# EAGLE schematic 5250_converter (EAGLE 9.6.1)
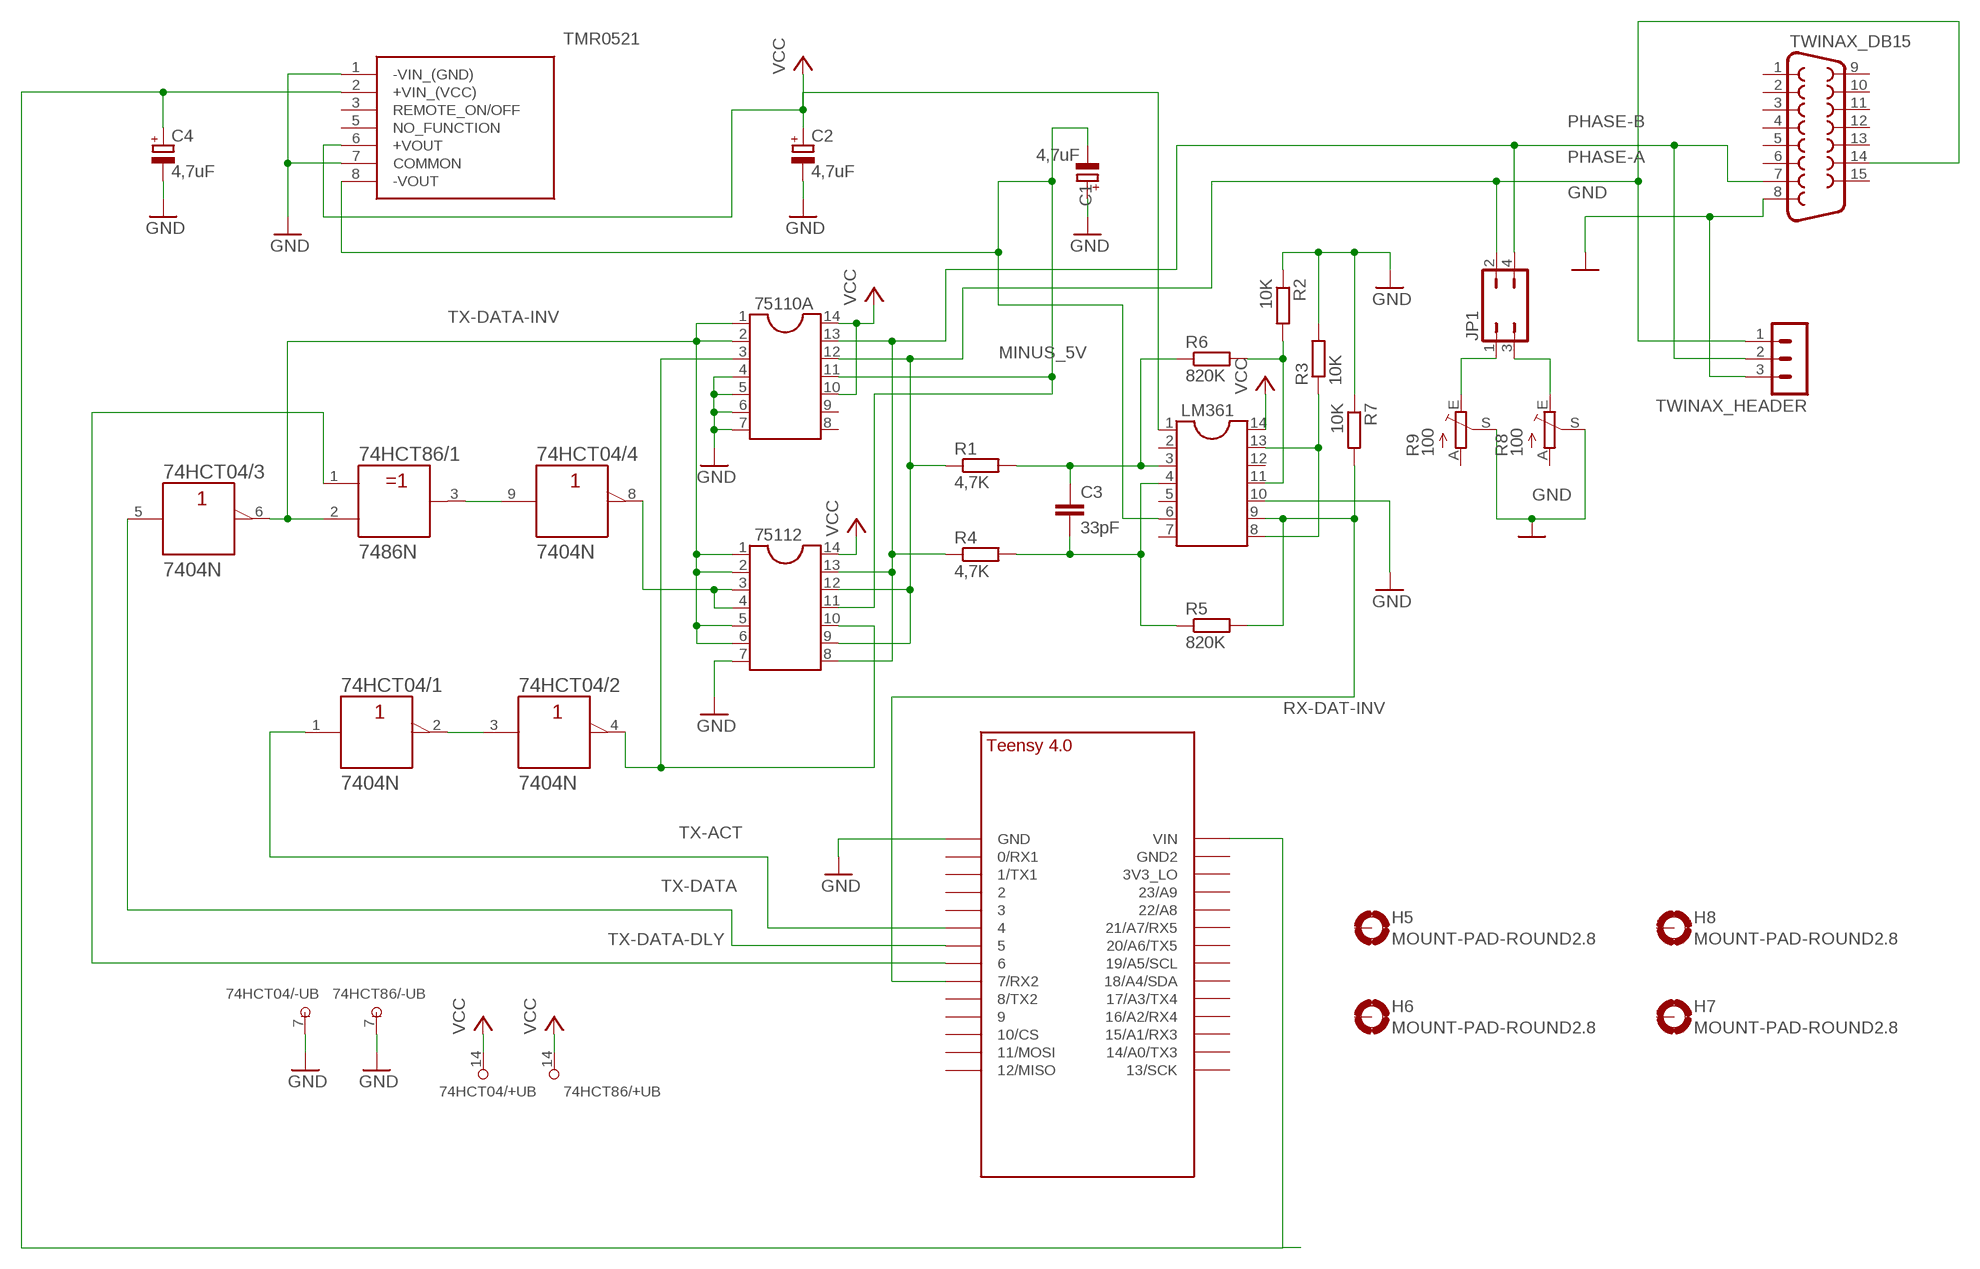
[diagram p0: schematic, sheet 1]

## Parts
74HCT04  7404N  [DIL14]
74HCT86  7486N  [DIL14]
75110A  DIL14  [DIL14]
75112  DIL14  [DIL14]
C1  4,7uF  CPOL-EUE2.5-6  [E2,5-6]
C2  4,7uF  CPOL-EUE2.5-6  [E2,5-6]
C3  33pF  C-EU050-030X075  [C050-030X075]
C4  4,7uF  CPOL-EUE2.5-6  [E2,5-6]
H5  MOUNT-PAD-ROUND2.8  [2,8-PAD]
H6  MOUNT-PAD-ROUND2.8  [2,8-PAD]
H7  MOUNT-PAD-ROUND2.8  [2,8-PAD]
H8  MOUNT-PAD-ROUND2.8  [2,8-PAD]
JP1  JP2Q  [JP2Q]
LM361  DIL14  [DIL14]
R1  4,7K  R-EU_0207/10  [0207/10]
R2  10K  R-EU_0207/10  [0207/10]
R3  10K  R-EU_0207/10  [0207/10]
R4  4,7K  R-EU_0207/10  [0207/10]
R5  820K  R-EU_0207/10  [0207/10]
R6  820K  R-EU_0207/10  [0207/10]
R7  10K  R-EU_0207/10  [0207/10]
R8  100  TRIM_EU-CA9V  [CA9V]
R9  100  TRIM_EU-CA9V  [CA9V]
TMR0521  TMR0521  TMR0521TMR0521  [TMR0521]
TWINAX_DB15  F15H  [F15H]
TWINAX_HEADER  MA03-1  [MA03-1]
U$1  TEENSY_4.0-BASIC  [TEENSY_4.0-BASIC]

## Nets
GND: 74HCT04.7(/-UB:-UB) 74HCT86.7(/-UB:-UB) 75110A.4 75110A.5 75110A.6 75110A.7 75112.7 C1.+ C2.- C4.- LM361.10 R2.1 R3.2 R7.1 R8.S R9.S TMR0521.1(-VIN_(GND)) TMR0521.7(COMMON) TWINAX_DB15.8 TWINAX_HEADER.3 U$1.GND
MINUS_5V: 75110A.11 75112.11 C1.- LM361.6 TMR0521.8(-VOUT)
N$2: 74HCT04.4(/2:Y) 75110A.3 75112.10
N$5: 74HCT04.2(/1:Y) 74HCT04.3(/2:A)
N$6: C4.+ TMR0521.2(+VIN_(VCC)) U$1.VIN
N$7: LM361.8 LM361.13 R3.1
N$10: C3.2 LM361.4 R4.2 R5.1
N$11: C3.1 LM361.3 R1.2 R6.1
N$12: LM361.11 R2.2 R6.2
N$13: JP1.3 R8.E
N$14: JP1.1 R9.E
N$20: 74HCT04.9(/4:A) 74HCT86.3(/1:Y)
N$21: 74HCT04.8(/4:Y) 75112.3 75112.4
PHASE-A: 75110A.12 75112.9 75112.12 JP1.2 R1.1 TWINAX_DB15.14 TWINAX_HEADER.1
PHASE-B: 75110A.13 75112.8 75112.13 JP1.4 R4.1 TWINAX_DB15.7 TWINAX_HEADER.2
RX-DAT-INV: LM361.9 R5.2 R7.2 U$1.7(7/RX2)
TX-ACT: 74HCT04.1(/1:A) U$1.4/CANRX
TX-DATA: 74HCT04.5(/3:A) U$1.5
TX-DATA-DLY: 74HCT86.1(/1:A) U$1.6
TX-DATA-INV: 74HCT04.6(/3:Y) 74HCT86.2(/1:B) 75110A.1 75110A.2 75112.1 75112.2 75112.5 75112.6
VCC: 74HCT04.14(/+UB:+UB) 74HCT86.14(/+UB:+UB) 75110A.10 75110A.14 75112.14 C2.+ LM361.1 LM361.14 TMR0521.6(+VOUT)
Unconnected: 74HCT04.10(/5:Y) 74HCT04.11(/5:A) 74HCT04.12(/6:Y) 74HCT04.13(/6:A) 74HCT86.4(/2:A) 74HCT86.5(/2:B) 74HCT86.6(/2:Y) 74HCT86.8(/3:Y) 74HCT86.9(/3:A) 74HCT86.10(/3:B) 74HCT86.11(/4:Y) 74HCT86.12(/4:A) 74HCT86.13(/4:B) 75110A.8 75110A.9 H5.B2,8(MOUNT) H6.B2,8(MOUNT) H7.B2,8(MOUNT) H8.B2,8(MOUNT) LM361.2 LM361.5 LM361.7 LM361.12 R8.A R9.A TMR0521.3(REMOTE_ON/OFF) TMR0521.5(NO_FUNCTION) TWINAX_DB15.1 TWINAX_DB15.2 TWINAX_DB15.3 TWINAX_DB15.4 TWINAX_DB15.5 TWINAX_DB15.6 TWINAX_DB15.9 TWINAX_DB15.10 TWINAX_DB15.11 TWINAX_DB15.12 TWINAX_DB15.13 TWINAX_DB15.15 U$1.0/RX(0/RX1) U$1.1/TX(1/TX1) U$1.2 U$1.3/CANTX U$1.3V3_LO U$1.8(8/TX2) U$1.9/CS U$1.10/CS U$1.11/MOSI U$1.12/MISO U$1.13/SCK U$1.14/A0(14/A0/TX3) U$1.15/A1(15/A1/RX3) U$1.16/A2(16/A2/RX4) U$1.17/A3(17/A3/TX4) U$1.18/A4/SDA U$1.19/A5/SCL U$1.20/A6(20/A6/TX5) U$1.21/A7(21/A7/RX5) U$1.22/A8 U$1.23/A9 U$1.GND2

## Library data of the parts
74HCT04 = 74ttl-din:74*04: Hex INVERTER
74HCT86 = 74ttl-din:74*86: Quad 2-input EXCLUSIV-OR gate
75110A 75112 LM361 = ic-package:DIL14: Dual In Line / Socket
C1 C2 C4 = rcl:CPOL-EU: POLARIZED CAPACITOR, European symbol; SPICEPREFIX: C
C3 = rcl:C-EU: CAPACITOR, European symbol; SPICEPREFIX: C
H5-H8 = holes:MOUNT-PAD-ROUND: MOUNTING PAD, round
JP1 = jumper:JP2Q: JUMPER
R1-R7 = rcl:R-EU_: RESISTOR, European symbol; SPICEPREFIX: R
R8 R9 = pot:TRIM_EU-: POTENTIOMETER
TMR0521 = TMR_3-2422:TMR0521: Isolated DC/DC Converters Product Type: DC/DC; Package Style: SIP-8; Output Power (W): 3; Input Voltage: 18-36 VDC; Output 1 (Vdc): 12; Output 2 (Vdc): -12; Output 3 (Vdc): N/A Source: Datasheet <https://www.mouser.com/datasheet/2/687/tmr3-519431.pdf>; ALLIED_NUMBER: 70420558; ALLIED_PRICE-STOCK: https://www.alliedelec.com/tracopower-tmr3-2422/70420558/; DESCRIPTION: Isolated DC/DC Converters Product Type: DC/DC; Package Style: SIP-8; Output Power (W): 3; Input Voltage: 18-36 VDC; Output 1 (Vdc): 12; Output 2 (Vdc): -12; Output 3 (Vdc): N/A; HEIGHT: 11.6mm; MANUFACTURER_NAME: Traco Power; MANUFACTURER_PART_NUMBER: TMR 3-2422; MOUSER_PART_NUMBER: 495-TMR-3-2422; MOUSER_PRICE-STOCK: https://www.mouser.co.uk/ProductDetail/TRACO-Power/TMR-3-2422?qs=ckJk83FOD0UAJ8brb7ViZQ%3D%3D; RS_PART_NUMBER: 0438082; RS_PRICE-STOCK: http://uk.rs-online.com/web/p/products/0438082
TWINAX_DB15 = con-subd:F15: SUB-D; OC_FARNELL: unknown; OC_NEWARK: unknown
TWINAX_HEADER = con-lstb:MA03-1: PIN HEADER; OC_FARNELL: unknown; OC_NEWARK: unknown
U$1 = Teensy-4.0:TEENSY_4.0-BASIC